# EAGLE design hand_brd (EAGLE 7.5.0)
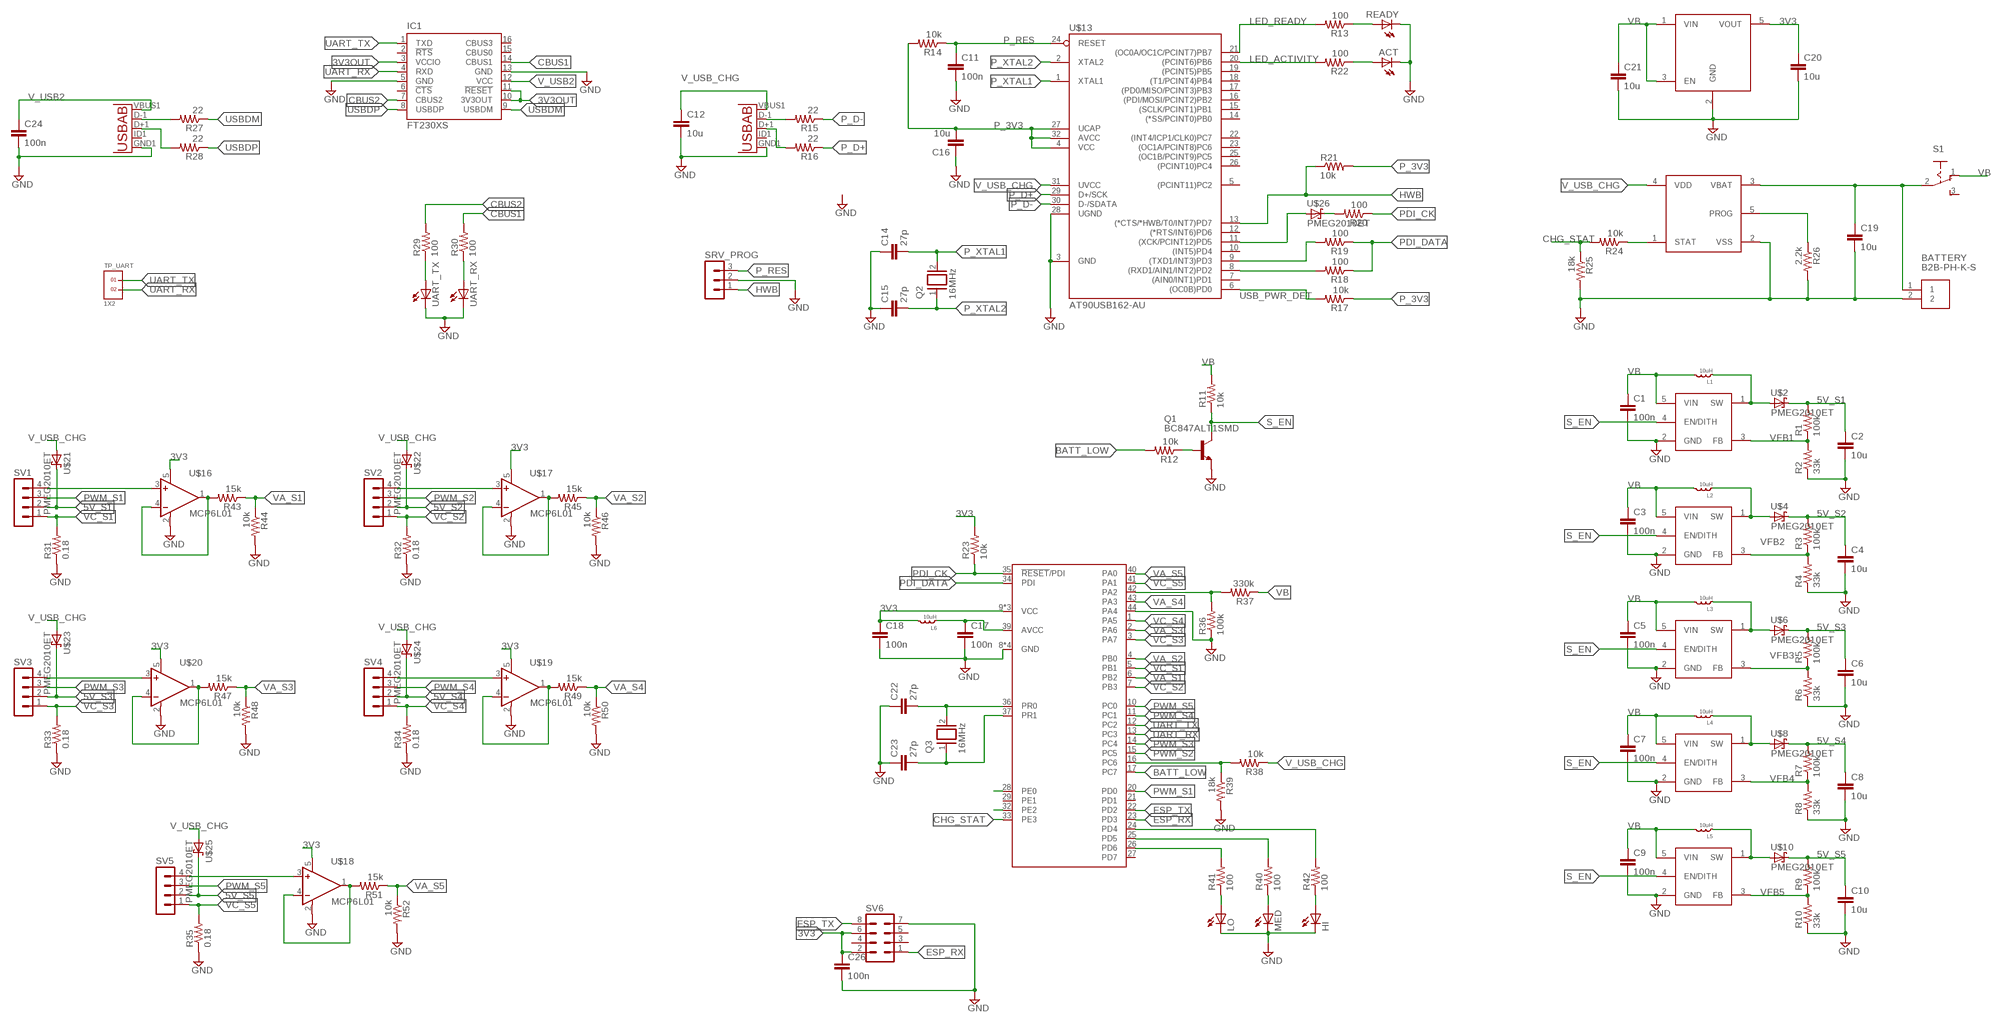
[diagram p0: schematic, sheet 1]

## Parts
ACT  LEDCHIPLED_0805  [CHIPLED_0805]
BATTERY  B2B-PH-K-S  [B2B-PH-K-S]
C1  100n  C-EUC0805K  [C0805K]
C2  10u  C-EUC0805K  [C0805K]
C3  100n  C-EUC0805K  [C0805K]
C4  10u  C-EUC0805K  [C0805K]
C5  100n  C-EUC0805K  [C0805K]
C6  10u  C-EUC0805K  [C0805K]
C7  100n  C-EUC0805K  [C0805K]
C8  10u  C-EUC0805K  [C0805K]
C9  100n  C-EUC0805K  [C0805K]
C10  10u  C-EUC0805K  [C0805K]
C11  100n  C-EUC0805K  [C0805K]
C12  10u  C-EUC0805K  [C0805K]
C14  27p  C-EUC0805K  [C0805K]
C15  27p  C-EUC0805K  [C0805K]
C16  10u  C-EUC0805K  [C0805K]
C17  100n  C-EUC0805K  [C0805K]
C18  100n  C-EUC0805K  [C0805K]
C19  10u  C-EUC0805K  [C0805K]
C20  10u  C-EUC0805K  [C0805K]
C21  10u  C-EUC0805K  [C0805K]
C22  27p  C-EUC0805K  [C0805K]
C23  27p  C-EUC0805K  [C0805K]
C24  100n  C-EUC0805K  [C0805K]
C26  100n  C-EUC0805K  [C0805K]
HI  LEDCHIPLED_0805  [CHIPLED_0805]
IC1  FT230XS  [SSOP16]
L1  10uH  L_TDK_LTF5022  [LTF5022]
L2  10uH  L_TDK_LTF5022  [LTF5022]
L3  10uH  L_TDK_LTF5022  [LTF5022]
L4  10uH  L_TDK_LTF5022  [LTF5022]
L5  10uH  L_TDK_LTF5022  [LTF5022]
L6  10uH  L_TDK_LTF5022  [LTF5022]
LO  LEDCHIPLED_0805  [CHIPLED_0805]
MED  LEDCHIPLED_0805  [CHIPLED_0805]
Q1  BC847ALT1SMD  [SOT23]
Q2  16MHz  XTAL/S  [QS]
Q3  16MHz  XTAL/S  [QS]
R1  100k  R-US_M0805  [M0805]
R2  33k  R-US_M0805  [M0805]
R3  100k  R-US_M0805  [M0805]
R4  33k  R-US_M0805  [M0805]
R5  100k  R-US_M0805  [M0805]
R6  33k  R-US_M0805  [M0805]
R7  100k  R-US_M0805  [M0805]
R8  33k  R-US_M0805  [M0805]
R9  100k  R-US_M0805  [M0805]
R10  33k  R-US_M0805  [M0805]
R11  10k  R-US_M0805  [M0805]
R12  10k  R-US_M0805  [M0805]
R13  100  R-US_M0805  [M0805]
R14  10k  R-US_M0805  [M0805]
R15  22  R-US_M0805  [M0805]
R16  22  R-US_M0805  [M0805]
R17  10k  R-US_M0805  [M0805]
R18  100  R-US_M0805  [M0805]
R19  100  R-US_M0805  [M0805]
R20  100  R-US_M0805  [M0805]
R21  10k  R-US_M0805  [M0805]
R22  100  R-US_M0805  [M0805]
R23  10k  R-US_M0805  [M0805]
R24  10k  R-US_M0805  [M0805]
R25  18k  R-US_M0805  [M0805]
R26  2.2k  R-US_M0805  [M0805]
R27  22  R-US_M0805  [M0805]
R28  22  R-US_M0805  [M0805]
R29  100  R-US_M0805  [M0805]
R30  100  R-US_M0805  [M0805]
R31  0.18  R-US_M0805  [M0805]
R32  0.18  R-US_M0805  [M0805]
R33  0.18  R-US_M0805  [M0805]
R34  0.18  R-US_M0805  [M0805]
R35  0.18  R-US_M0805  [M0805]
R36  100k  R-US_M0805  [M0805]
R37  330k  R-US_M0805  [M0805]
R38  10k  R-US_M0805  [M0805]
R39  18k  R-US_M0805  [M0805]
R40  100  R-US_M0805  [M0805]
R41  100  R-US_M0805  [M0805]
R42  100  R-US_M0805  [M0805]
R43  15k  R-US_M0805  [M0805]
R44  10k  R-US_M0805  [M0805]
R45  15k  R-US_M0805  [M0805]
R46  10k  R-US_M0805  [M0805]
R47  15k  R-US_M0805  [M0805]
R48  10k  R-US_M0805  [M0805]
R49  15k  R-US_M0805  [M0805]
R50  10k  R-US_M0805  [M0805]
R51  15k  R-US_M0805  [M0805]
R52  10k  R-US_M0805  [M0805]
READY  LEDCHIPLED_0805  [CHIPLED_0805]
S1  255SB  [255SB]
SRV_PROG  MA03-1  [MA03-1]
SV1  MA04-1  [MA04-1]
SV2  MA04-1  [MA04-1]
SV3  MA04-1  [MA04-1]
SV4  MA04-1  [MA04-1]
SV5  MA04-1  [MA04-1]
SV6  MA04-2  [MA04-2]
TP_UART  1X2  [1X2]
U1  USB""  [USB-MICRO-SMD]
U2  ATXMEGA128D4-AU  [TQFP-44A-44]
U3  USB""  [USB-MICRO-SMD]
U$1  MIC2250-2YD5  [SOT23-5]
U$2  PMEG2010ET  [SOT23]
U$3  MIC2250-2YD5  [SOT23-5]
U$4  PMEG2010ET  [SOT23]
U$5  MIC2250-2YD5  [SOT23-5]
U$6  PMEG2010ET  [SOT23]
U$7  MIC2250-2YD5  [SOT23-5]
U$8  PMEG2010ET  [SOT23]
U$9  MIC2250-2YD5  [SOT23-5]
U$10  PMEG2010ET  [SOT23]
U$13  AT90USB162-AU  [TQFP32-08]
U$14  MCP73831  [SOT23-5]
U$15  MIC5504  [SOT23-5]
U$16  MCP6L01  [SOT23-5]
U$17  MCP6L01  [SOT23-5]
U$18  MCP6L01  [SOT23-5]
U$19  MCP6L01  [SOT23-5]
U$20  MCP6L01  [SOT23-5]
U$21  PMEG2010ET  [SOT23]
U$22  PMEG2010ET  [SOT23]
U$23  PMEG2010ET  [SOT23]
U$24  PMEG2010ET  [SOT23]
U$25  PMEG2010ET  [SOT23]
U$26  PMEG2010ET  [SOT23]
UART_RX  LEDCHIPLED_0805  [CHIPLED_0805]
UART_TX  LEDCHIPLED_0805  [CHIPLED_0805]

## Nets
3V3: C18.1 C20.1 C26.1 L6.P$2 R23.2 SV6.2 SV6.6 U2.9(VCC) U2.19(VCC) U2.31(VCC) U$15.5(VOUT) U$16.5(V+) U$17.5(V+) U$18.5(V+) U$19.5(V+) U$20.5(V+)
3V3OUT: IC1.3(VCCIO) IC1.10(3V3OUT) IC1.11(!RESET)
5V_S1: C2.1 R1.2 SV1.2 U$2.3(C) U$21.3(C)
5V_S2: C4.1 R3.2 SV2.2 U$4.3(C) U$22.3(C)
5V_S3: C6.1 R5.2 SV3.2 U$6.3(C) U$23.3(C)
5V_S4: C8.1 R7.2 SV4.2 U$8.3(C) U$24.3(C)
5V_S5: C10.1 R9.2 SV5.2 U$10.3(C) U$25.3(C)
BATT_LOW: R12.2 U2.17(PC7)
CBUS1: IC1.14(CBUS1) R30.2
CBUS2: IC1.7(CBUS2) R29.2
CHG_STAT: R24.2 R25.1 U2.33(PE3)
ESP_RX: SV6.1 U2.23(PD3)
ESP_TX: SV6.8 U2.22(PD2)
GND: ACT.C BATTERY.2 C1.2 C2.2 C3.2 C4.2 C5.2 C6.2 C7.2 C8.2 C9.2 C10.2 C11.2 C12.2 C14.1 C15.1 C16.1 C17.2 C18.2 C19.2 C20.2 C21.2 C22.1 C23.1 C24.2 C26.2 HI.C IC1.5(GND) IC1.13(GND) LO.C MED.C Q1.2(E) R2.1 R4.1 R6.1 R8.1 R10.1 R25.2 R26.2 R31.1 R32.1 R33.1 R34.1 R35.1 R36.1 R39.2 R44.2 R46.2 R48.2 R50.2 R52.2 READY.C SRV_PROG.2 SV6.7 U1.GND1(GND) U2.8(GND) U2.18(GND) U2.30(GND) U2.38(GND) U2.44(PA4) U3.GND1(GND) U$1.2(GND) U$3.2(GND) U$5.2(GND) U$7.2(GND) U$9.2(GND) U$13.3(GND) U$13.28(UGND) U$14.2(VSS) U$15.2(GND) U$16.2(V-) U$17.2(V-) U$18.2(V-) U$19.2(V-) U$20.2(V-) UART_RX.C UART_TX.C
HWB: R21.1 SRV_PROG.1 U$13.13((*CTS/*HWB/T0/INT7)PD7)
LED_ACTIVITY: R22.2 U$13.20((PCINT6)PB6)
LED_READY: R13.2 U$13.21((OC0A/OC1C/PCINT7)PB7)
N$1: L2.P$1 U$3.1(SW) U$4.1(A)
N$2: L1.P$1 U$1.1(SW) U$2.1(A)
N$3: R18.2 U$13.8((RXD1/AIN1/INT2)PD2)
N$4: L3.P$1 U$5.1(SW) U$6.1(A)
N$5: Q1.1(B) R12.1
N$7: L4.P$1 U$7.1(SW) U$8.1(A)
N$8: R16.2 U3.D+1(D+)
N$9: L5.P$1 U$9.1(SW) U$10.1(A)
N$10: R15.2 U3.D-1(D-)
N$11: R20.2 U$26.3(C)
N$13: R19.2 U$13.9((TXD1/INT3)PD3)
N$14: U$13.11((XCK/PCINT12)PD5) U$26.1(A)
N$15: R13.1 READY.A
N$16: ACT.A R22.1
N$17: C17.1 L6.P$1 U2.39(AVCC)
N$18: R27.2 U1.D-1(D-)
N$19: R24.1 U$14.1(STAT)
N$20: R26.1 U$14.5(PROG)
N$21: BATTERY.1 C19.1 S1.2(P) U$14.3(VBAT)
N$22: R28.2 U1.D+1(D+)
N$25: R29.1 UART_TX.A
N$26: R30.1 UART_RX.A
N$34: R36.2 R37.2 U2.42(PA2)
N$35: R38.2 R39.1 U2.16(PC6)
N$36: SV2.4 U$17.3(+IN)
N$37: SV1.4 U$16.3(+IN)
N$38: SV5.4 U$18.3(+IN)
N$39: MED.A R40.1
N$40: SV3.4 U$20.3(+IN)
N$41: SV4.4 U$19.3(+IN)
N$42: LO.A R41.1
N$43: HI.A R42.1
N$44: R41.2 U2.26(PD6)
N$45: R40.2 U2.25(PD5)
N$46: R42.2 U2.24(PD4)
N$48: U2.28(PE0)
N$50: R45.2 U$17.1(OUT) U$17.4(-IN)
N$51: U2.32(PE2)
N$52: R43.2 U$16.1(OUT) U$16.4(-IN)
N$53: R47.2 U$20.1(OUT) U$20.4(-IN)
N$54: R49.2 U$19.1(OUT) U$19.4(-IN)
N$55: R51.2 U$18.1(OUT) U$18.4(-IN)
P_3V3: C16.2 R14.2 R17.1 R21.2 U$13.4(VCC) U$13.27(UCAP) U$13.32(AVCC)
P_D+: R16.1 U$13.29(D+/SCK)
P_D-: R15.1 U$13.30(D-/SDATA)
P_RES: C11.1 R14.1 SRV_PROG.3 U$13.24(RESET)
P_XTAL1: C14.2 Q2.2 U$13.1(XTAL1)
P_XTAL2: C15.2 Q2.1 U$13.2(XTAL2)
PDI_CK: R20.1 R23.1 U2.35(!RESET!/PDI)
PDI_DATA: R18.1 R19.1 U2.34(PDI)
PWM_S1: SV1.3 U2.20(PD0)
PWM_S2: SV2.3 U2.15(PC5)
PWM_S3: SV3.3 U2.14(PC4)
PWM_S4: SV4.3 U2.11(PC1)
PWM_S5: SV5.3 U2.10(PC0)
S_EN: Q1.3(C) R11.1 U$1.4(EN/DITH) U$3.4(EN/DITH) U$5.4(EN/DITH) U$7.4(EN/DITH) U$9.4(EN/DITH)
UART_RX: IC1.4(RXD) TP_UART.2 U2.13(PC3)
UART_TX: IC1.1(TXD) TP_UART.1 U2.12(PC2)
USB_PWR_DET: R17.2 U$13.6((OC0B)PD0)
USBDM: IC1.9(USBDM) R27.1
USBDP: IC1.8(USBDP) R28.1
V_USB2: C24.1 IC1.12(VCC) U1.VBUS1(VBUS)
V_USB_CHG: C12.1 R38.1 U3.VBUS1(VBUS) U$13.31(UVCC) U$14.4(VDD) U$21.1(A) U$22.1(A) U$23.1(A) U$24.1(A) U$25.1(A)
VA_S1: R43.1 R44.1 U2.6(PB2)
VA_S2: R45.1 R46.1 U2.4(PB0)
VA_S3: R47.1 R48.1 U2.2(PA6)
VA_S4: R49.1 R50.1 U2.43(PA3)
VA_S5: R51.1 R52.1 U2.40(PA0)
VB: C1.1 C3.1 C5.1 C7.1 C9.1 C21.1 L1.P$2 L2.P$2 L3.P$2 L4.P$2 L5.P$2 R11.2 R37.1 S1.1(O) U$1.5(VIN) U$3.5(VIN) U$5.5(VIN) U$7.5(VIN) U$9.5(VIN) U$15.1(VIN) U$15.3(EN)
VC_S1: R31.2 SV1.1 U2.5(PB1)
VC_S2: R32.2 SV2.1 U2.7(PB3)
VC_S3: R33.2 SV3.1 U2.3(PA7)
VC_S4: R34.2 SV4.1 U2.1(PA5)
VC_S5: R35.2 SV5.1 U2.41(PA1)
VFB1: R1.1 R2.2 U$1.3(FB)
VFB2: R3.1 R4.2 U$3.3(FB)
VFB3: R5.1 R6.2 U$5.3(FB)
VFB4: R7.1 R8.2 U$7.3(FB)
VFB5: R9.1 R10.2 U$9.3(FB)
XTAL1: C22.2 Q3.2 U2.36(PR0)
XTAL2: C23.2 Q3.1 U2.37(PR1)
Unconnected: IC1.2(!RTS) IC1.6(!CTS) IC1.15(CBUS0) IC1.16(CBUS3) S1.3(S) SV6.3 SV6.4 SV6.5 U1.ID1(USBID) U2.21(PD1) U2.27(PD7) U2.29(PE1) U3.ID1(USBID) U$13.5((PCINT11)PC2) U$13.7((AIN0/INT1)PD1) U$13.10((INT5)PD4) U$13.12((*RTS/INT6)PD6) U$13.14((*SS/PCINT0)PB0) U$13.15((SCLK/PCINT1)PB1) U$13.16((PDI/MOSI/PCINT2)PB2) U$13.17((PD0/MISO/PCINT3)PB3) U$13.18((T1/PCINT4)PB4) U$13.19((PCINT5)PB5) U$13.22((INT4/ICP1/CLK0)PC7) U$13.23((OC1A/PCINT8)PC6) U$13.25((OC1B/PCINT9)PC5) U$13.26((PCINT10)PC4)

## Library data of the parts
ACT HI LO MED READY UART_RX UART_TX = led:LED: LED OSRAM: - CHIPLED LG R971, LG N971, LY N971, LG Q971, LY Q971, LO R971, LY R971 LH N974, LH R974 LS Q976, LO Q976, LY Q976 LO Q996 - Hyper CHIPLED LW Q18S LB Q993, LB Q99A, LB R99A - SideLED LS A670, LO A670, LY A670, LG A670, LP A670 LB A673, LV A673, LT A673, LW A673 LH A674 LY A675 LS A676, LA A676, LO A676, LY A676, LW A676 LS A679, LY A679, LG A679 - Hyper Micro SIDELED® LS Y876, LA Y876, LO Y876, LY Y876 LT Y87S - SmartLED LW L88C, LW L88S LB L89C, LB L89S, LG L890 LS L89K, LO L89K, LY L89K LS L896, LA L896, LO L896, LY L896 - TOPLED LS T670, LO T670, LY T670, LG T670, LP T670 LSG T670, LSP T670, LSY T670, LOP T670, LYG T670 LG T671, LOG T671, LSG T671 LB T673, LV T673, LT T673, LW T673 LH T674 LS T676, LA T676, LO T676, LY T676, LB T676, LH T676, LSB T676, LW T676 LB T67C, LV T67C, LT T67C, LS T67K, LO T67K, LY T67K, LW E67C LS E67B, LA E67B, LO E67B, LY E67B, LB E67C, LV E67C, LT E67C LW T67C LS T679, LY T679, LG T679 LS T770, LO T770, LY T770, LG T770, LP T770 LB T773, LV T773, LT T773, LW T773 LH T774 LS E675, LA E675, LY E675, LS T675 LS T776, LA T776, LO T776, LY T776, LB T776 LHGB T686 LT T68C, LB T68C - Hyper Mini TOPLED® LB M676 - Mini TOPLED Santana® LG M470 LS M47K, LO M47K, LY M47K Source: http://www.osram.convergy.de LUXEON: - LUMILED® LXK2-PW12-R00, LXK2-PW12-S00, LXK2-PW14-U00, LXK2-PW14-V00 LXK2-PM12-R00, LXK2-PM12-S00, LXK2-PM14-U00 LXK2-PE12-Q00, LXK2-PE12-R00, LXK2-PE12-S00, LXK2-PE14-T00, LXK2-PE14-U00 LXK2-PB12-K00, LXK2-PB12-L00, LXK2-PB12-M00, LXK2-PB14-N00, LXK2-PB14-P00, LXK2-PB14-Q00 LXK2-PR12-L00, LXK2-PR12-M00, LXK2-PR14-Q00, LXK2-PR14-R00 LXK2-PD12-Q00, LXK2-PD12-R00, LXK2-PD12-S00 LXK2-PH12-R00, LXK2-PH12-S00 LXK2-PL12-P00, LXK2-PL12-Q00, LXK2-PL12-R00 Source: www.luxeon.com KINGBRIGHT: KA-3528ASYC Source: www.kingbright.com
BATTERY = jst:B2B-PH-K-S
C1-C12 C14-C24 C26 = rcl:C-EU: CAPACITOR, European symbol
IC1 = ftdi:FT230X: USB to BASIC UART IC Auto generated by make-symbol-device-package-bsdl.ulp Rev. 43 Source: Data sheet <http://www.ftdichip.com/Support/Documents/DataSheets/ICs/DS_FT230X.pdf>
L1-L6 = pol:L_TDK_LTF5022
Q1 = transistor-npn:BC847*: NPN Transistor
Q2 Q3 = special:XTAL/S: CRYSTAL
R1-R52 = rcl:R-US_: RESISTOR, American symbol
S1 = switch:255SB: SLIDING SWITCH Distributor Buerklin, 11G810
SRV_PROG = con-lstb:MA03-1: PIN HEADER; OC_FARNELL: unknown; OC_NEWARK: unknown
SV1-SV5 = con-lstb:MA04-1: PIN HEADER; OC_FARNELL: unknown; OC_NEWARK: unknown
SV6 = con-lstb:MA04-2: PIN HEADER; OC_FARNELL: unknown; OC_NEWARK: unknown
TP_UART = headers(2mm):1X2
U1 U3 = MicroUSB:USB: This is a USB AB connector that is compatible with USB OTG. i.e. this connector can serve as a host or device
U2 = atmel-xmega:ATXMEGA128D4: 8/16-bit XMEGA C4 Microcontroller Features High-performance, Low-power 8/16-bit Atmel® AVR® XMEGA® Microcontroller Non-volatile Program and Data Memories – 16 KB - 128 KB of In-System Self-Programmable Flash – 4 KB - 8 KB Boot Code Section with Independent Lock Bits – 1 KB - 2 KB EEPROM – 2 KB - 8 KB Internal SRAM Peripheral Features – Four-channel Event System – Four 16-bit Timer/Counters Three Timer/Counters with 4 Output Compare or Input Capture channels One Timer/Counter with 2 Output Compare or Input Capture channels High-Resolution Extensions on two Timer/Counters Advanced Waveform Extension on one Timer/Counter – Two USARTs IrDA Extension on one USART – Two Two-Wire Interfaces with dual address match (I2C and SMBus compatible) – Two SPIs (Serial Peripheral Interfaces) peripherals – 16-bit Real Time Counter with Separate Oscillator – One Twelve-channel, 12-bit, 200 ksps Analog to Digital Converter – Two Analog Comparators with Window compare function – External Interrupts on all General Purpose I/O pins – Programmable Watchdog Timer with Separate On-chip Ultra Low Power Oscillator Special Microcontroller Features – Power-on Reset and Programmable Brown-out Detection – Internal and External Clock Options with PLL – Programmable Multi-level Interrupt Controller – Sleep Modes: Idle, Power-down, Standby, Power-save, Extended Standby – Advanced Programming, Test and Debugging Interface PDI (Program and Debug Interface) for programming, test and debugging I/O and Packages – 34 Programmable I/O Lines – 44-lead TQFP – 44-pad VQFN/QFN – 49-ball VFBGA Operating Voltage – 1.6 – 3.6V Speed performance – 0 – 12 MHz @ 1.6 – 3.6V – 0 – 32 MHz @ 2.7 – 3.6V
U$1 U$3 U$5 U$7 U$9 = pol:MIC2250-2YD5
U$2 U$4 U$6 U$8 U$10 U$21-U$26 = pol:PMEG2010ET
U$13 = at90usb:AT90USB162-*
U$14 = pol:MCP73831
U$15 = pol:MIC5504
U$16-U$20 = pol:MCP6L01: MCP6L01 1.8-6V rail to rail opamp

## Board
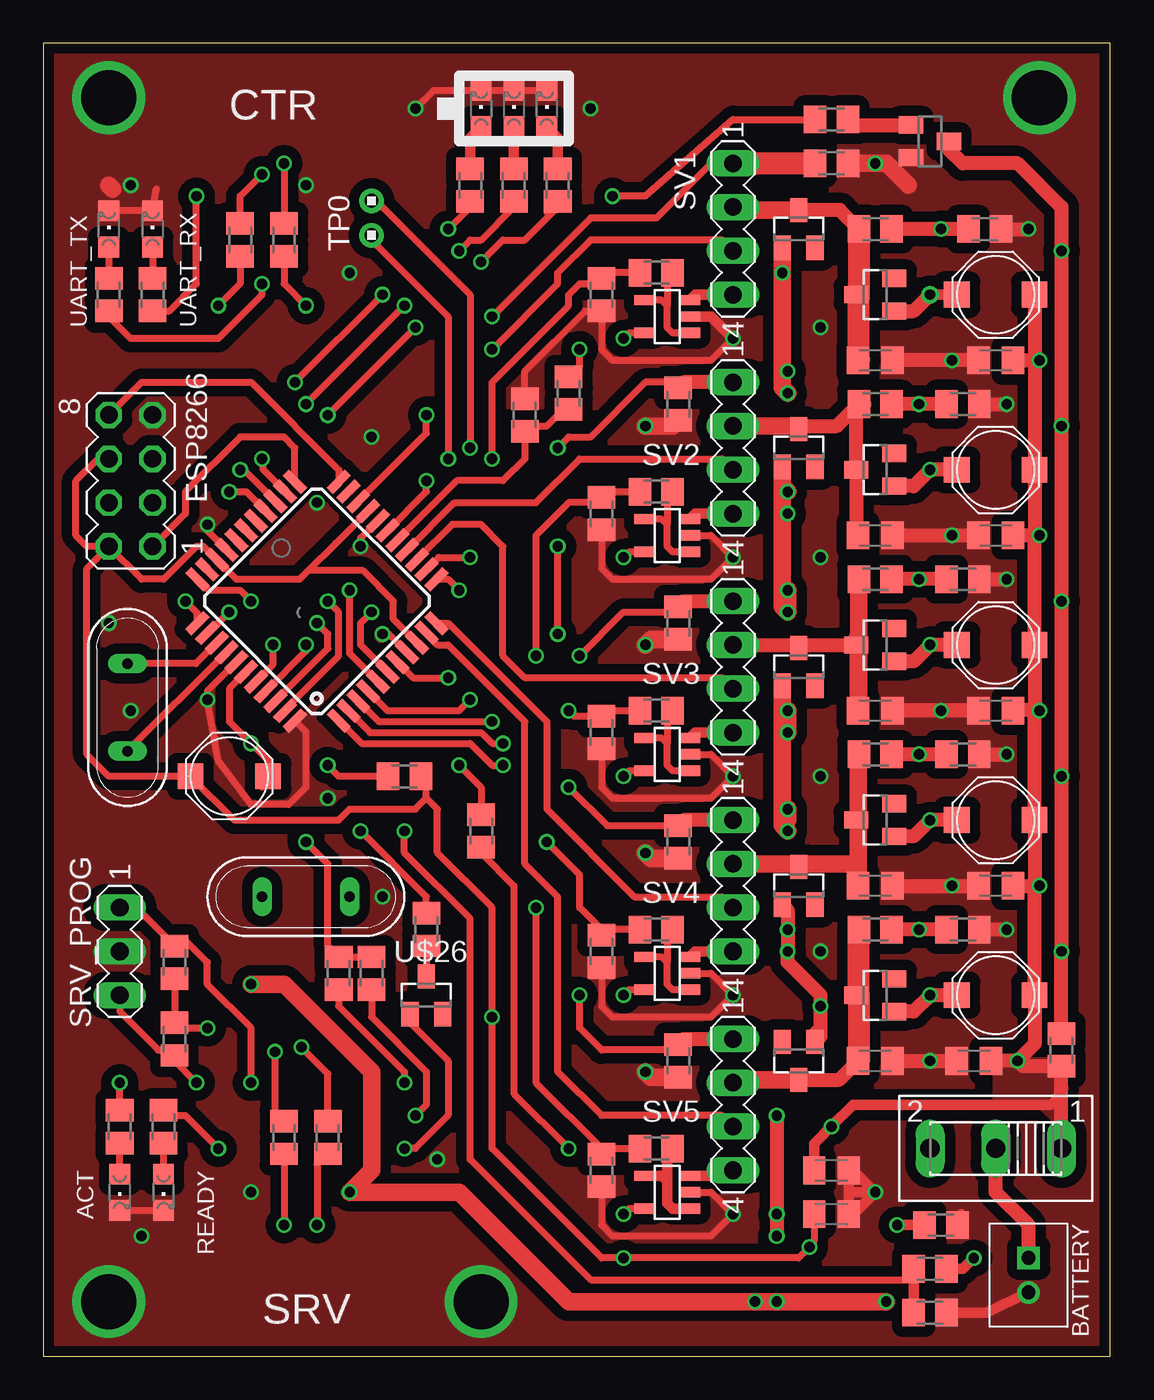
[diagram p1: board, top side]
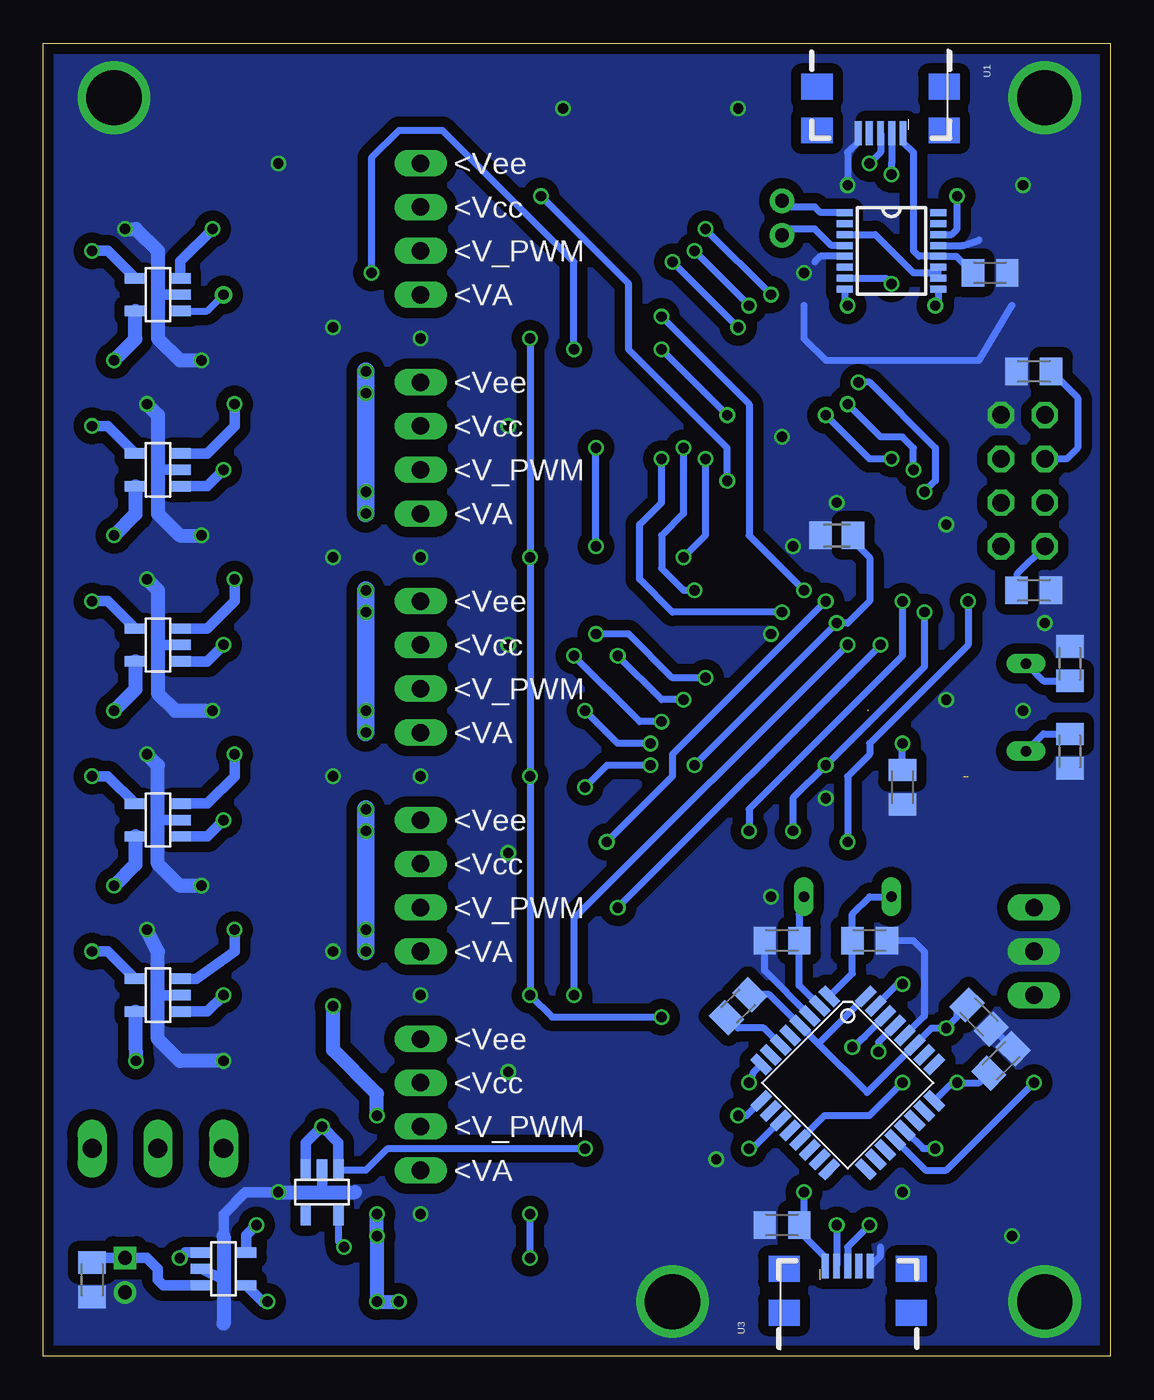
[diagram p2: board, bottom side, seen from below]

Size 61.9 x 76.19 mm. Coordinates in mm from the lower left corner, seen from the top.
Outline: 0,0 61.9,0 61.9,76.19 0,76.19 0,0
Copper layers (1*16): Top 0.035mm / dielectric 1.5mm / Bottom 0.035mm
Design rules "dirt_cheap_dirty_boards.v1": minimum track width 5mil, minimum drill 12mil, track to track 5mil, track to pad 5mil, pad to pad 5mil, via to via 5mil, smd to smd 0mil, copper to edge 10mil, drill to drill 10mil, minimum pad ring 10mil, minimum via ring 6mil, stop-mask expansion 2mil, vias tented up to drill 25mil, thermal gap 10mil

### Footprints (pad centres in the part's own frame; a part is rotated, then mirrored left to right if it is on the bottom)
CHIPLED_0805 = smd 1.2 x 1.2: A 0,-1.05; C 0,1.05
B2B-PH-K-S = drill 0.8 square: 1 0,0 | drill 0.8: 2 2,0
C0805K = smd 1.3 x 1.6: 1 -1,0; 2 1,0
SSOP16 = smd 0.914 x 0.406: 1 -2.718,2.223; 2 -2.718,1.587; 3 -2.718,0.953; 4 -2.718,0.318; 5 -2.718,-0.318; 6 -2.718,-0.953; 7 -2.718,-1.587; 8 -2.718,-2.223; 9 2.718,-2.223; 10 2.718,-1.587; 11 2.718,-0.953; 12 2.718,-0.318; 13 2.718,0.318; 14 2.718,0.953; 15 2.718,1.587; 16 2.718,2.223
LTF5022 = smd 1.5 x 1.5: P$1 -2.25,0; P$2 2.25,0
SOT23 = smd 1 x 1.4: 1 -0.95,-1.1; 2 0.95,-1.1; 3 0,1.1
QS = drill 0.61 long: 1 -2.54,0; 2 2.54,0
M0805 = smd 1.3 x 1.6: 1 -0.95,0; 2 0.95,0
255SB = drill 1.118 long: 1 -3.81,0; 2 0,0; 3 3.81,0
MA03-1 = drill 1.016 long: 1 -2.54,0; 2 0,0; 3 2.54,0
MA04-1 = drill 1.016 long: 1 -3.81,0; 2 -1.27,0; 3 1.27,0; 4 3.81,0
MA04-2 = drill 1.016 octagon: 1 -3.81,-1.27; 2 -3.81,1.27; 3 -1.27,-1.27; 4 -1.27,1.27; 5 1.27,-1.27; 6 1.27,1.27; 7 3.81,-1.27; 8 3.81,1.27
1X2 = drill 0.8 pad 1.422: 1 -1,0; 2 1,0
USB-MICRO-SMD = smd 1.4 x 0.4: D+1 2.7,0; D-1 2.7,0.65; GND1 2.7,-1.3; ID1 2.7,-0.65; VBUS1 2.7,1.3
TQFP-44A-44 = smd 1.5 x 0.5: 1 -5.8,4; 2 -5.8,3.2; 3 -5.8,2.4; 4 -5.8,1.6; 5 -5.8,0.8; 6 -5.8,0; 7 -5.8,-0.8; 8 -5.8,-1.6; 9 -5.8,-2.4; 10 -5.8,-3.2; 11 -5.8,-4; 23 5.8,-4; 24 5.8,-3.2; 25 5.8,-2.4; 26 5.8,-1.6; 27 5.8,-0.8; 28 5.8,0; 29 5.8,0.8; 30 5.8,1.6; 31 5.8,2.4; 32 5.8,3.2; 33 5.8,4 | smd 0.5 x 1.5: 12 -4,-5.8; 13 -3.2,-5.8; 14 -2.4,-5.8; 15 -1.6,-5.8; 16 -0.8,-5.8; 17 0,-5.8; 18 0.8,-5.8; 19 1.6,-5.8; 20 2.4,-5.8; 21 3.2,-5.8; 22 4,-5.8; 34 4,5.8; 35 3.2,5.8; 36 2.4,5.8; 37 1.6,5.8; 38 0.8,5.8; 39 0,5.8; 40 -0.8,5.8; 41 -1.6,5.8; 42 -2.4,5.8; 43 -3.2,5.8; 44 -4,5.8
SOT23-5 = smd 0.6 x 1.2: 1 -0.95,-1.306; 2 0,-1.306; 3 0.95,-1.306; 4 0.95,1.306; 5 -0.95,1.306
TQFP32-08 = smd 1.27 x 0.533: 1 -4.293,2.8; 2 -4.293,2; 3 -4.293,1.2; 4 -4.293,0.4; 5 -4.293,-0.4; 6 -4.293,-1.2; 7 -4.293,-2; 8 -4.293,-2.8; 17 4.293,-2.8; 18 4.293,-2; 19 4.293,-1.2; 20 4.293,-0.4; 21 4.293,0.4; 22 4.293,1.2; 23 4.293,2; 24 4.293,2.8 | smd 0.533 x 1.27: 9 -2.8,-4.293; 10 -2,-4.293; 11 -1.2,-4.293; 12 -0.4,-4.293; 13 0.4,-4.293; 14 1.2,-4.293; 15 2,-4.293; 16 2.8,-4.293; 25 2.8,4.293; 26 2,4.293; 27 1.2,4.293; 28 0.4,4.293; 29 -0.4,4.293; 30 -1.2,4.293; 31 -2,4.293; 32 -2.8,4.293

### Placement (x,y rotation side)
ACT  4.45,9.53 180 top
BATTERY  57.15,5.71 270 top
C1  55.25,57.78 180 top
C2  48.26,57.78 0 top
C3  55.25,47.62 180 top
C4  48.26,47.62 0 top
C5  55.25,27.31 180 top
C6  48.26,37.46 0 top
C7  55.25,37.46 180 top
C8  48.26,27.31 0 top
C9  53.97,17.15 180 top
C10  48.26,17.15 0 top
C11  6.35,17.15 45 bottom
C12  19.05,7.62 180 bottom
C14  13.97,24.13 180 bottom
C15  19.05,24.13 0 bottom
C16  7.62,19.69 135 bottom
C17  12.06,33.02 270 bottom
C18  4.45,44.45 0 bottom
C19  59.06,4.45 270 bottom
C20  45.72,8.26 0 top
C21  45.72,10.79 0 top
C22  2.35,40.19 270 bottom
C23  2.35,35.11 90 bottom
C24  6.98,62.86 0 bottom
C26  4.45,57.15 180 bottom
HI  29.21,72.39 0 top
IC1  12.7,64.14 0 bottom
L1  55.25,61.59 0 top
L2  55.25,51.43 0 top
L3  55.25,41.27 0 top
L4  55.25,31.12 0 top
L5  55.25,20.96 0 top
L6  10.8,33.66 180 top
LO  25.4,72.39 0 top
MED  27.31,72.39 0 top
Q1  51.44,70.48 270 top
Q2  15.24,26.67 180 top
Q3  4.89,37.65 90 top
R1  48.26,65.41 180 top
R2  54.61,65.41 180 top
R3  48.26,55.24 180 top
R4  53.34,55.24 180 top
R5  48.26,45.09 180 top
R6  53.34,45.09 180 top
R7  48.26,34.92 180 top
R8  53.34,34.92 180 top
R9  48.26,24.77 180 top
R10  53.34,24.77 180 top
R11  59.06,17.78 270 top
R12  45.72,71.76 180 top
R13  6.98,13.33 90 top
R14  7.62,18.42 90 top
R15  16.51,12.7 270 top
R16  13.97,12.7 270 top
R17  21.59,20.32 225 bottom
R18  17.15,22.23 270 top
R19  19.05,22.23 270 top
R20  22.23,24.77 270 top
R21  7.62,22.86 270 top
R22  4.45,13.33 90 top
R23  20.95,33.66 0 top
R24  51.44,5.08 180 top
R25  51.44,2.54 0 top
R26  52.07,7.62 0 top
R27  11.43,64.77 90 top
R28  13.97,64.77 90 top
R29  3.81,61.59 270 top
R30  6.35,61.59 270 top
R31  45.72,69.22 180 top
R32  36.83,55.24 90 top
R33  36.83,42.54 90 top
R34  36.83,29.85 90 top
R35  36.83,17.15 90 top
R36  15.88,47.62 0 bottom
R37  25.4,30.48 90 top
R38  30.48,55.88 270 top
R39  27.94,54.61 90 top
R40  27.31,67.95 270 top
R41  24.77,67.95 270 top
R42  29.84,67.95 270 top
R43  35.56,62.86 0 top
R44  32.39,61.59 270 top
R45  35.56,50.16 0 top
R46  32.39,48.89 270 top
R47  35.56,37.46 0 top
R48  32.39,36.2 270 top
R49  35.56,24.77 0 top
R50  32.39,23.5 270 top
R51  35.56,12.06 0 top
R52  32.39,10.79 270 top
READY  6.98,9.53 180 top
S1  55.25,12.06 180 top
SRV_PROG  4.45,23.5 270 top
SV1  40,65.41 270 top
SV2  40,52.7 270 top
SV3  40,40 270 top
SV4  40,27.31 270 top
SV5  40,14.61 270 top
SV6  5.08,50.8 90 top
TP_UART  19.05,66.04 270 top
U1  13.34,73.66 270 bottom
U2  15.88,43.81 135 top
U3  15.24,2.54 90 bottom
U$1  55.25,61.59 90 bottom
U$2  48.26,61.59 90 top
U$3  55.25,51.43 90 bottom
U$4  48.26,51.43 90 top
U$5  55.25,41.27 90 bottom
U$6  48.26,41.27 90 top
U$7  55.25,31.12 90 bottom
U$8  48.26,31.12 90 top
U$9  55.25,20.96 90 bottom
U$10  48.26,20.96 90 top
U$13  15.24,15.88 315 bottom
U$14  51.44,5.08 270 bottom
U$15  45.72,9.53 180 bottom
U$16  36.2,60.32 90 top
U$17  36.2,47.62 90 top
U$18  36.2,9.53 90 top
U$19  36.2,22.23 90 top
U$20  36.2,34.92 90 top
U$21  43.81,65.41 0 top
U$22  43.81,52.7 0 top
U$23  43.81,40 0 top
U$24  43.81,27.31 0 top
U$25  43.81,17.15 180 top
U$26  22.23,20.96 0 top
UART_RX  6.35,65.41 0 top
UART_TX  3.81,65.41 0 top

### Tracks (layer width: path | path; a pad name or v marks a point on that pad's centre or on a via)
3V3  (via drill 0.6)  (1 unrouted)
  Top 0.406: 34.61,33.98 U$20.5 33.97,33.98 v33.66,33.66 | 15.38,45.58 14.88,45.09 11.21,45.09 U2.31 9.31,46.99 8.89,46.99 6.98,45.09 5.72,45.09 SV6.2 | 15.38,45.58 16.97,47.17 U2.19 | SV6.2 2.54,46.99 1.91,47.62 1.91,50.8 3.17,52.07 SV6.6 | U$18.5 33.97,8.58 v33.66,8.26 | C20.1 44.72,6.71 v44.45,6.35 43.81,5.71 v33.66,5.71 32.39,5.71 26.03,12.06 v26.03,19.69 26.03,26.04 22.86,29.21 22.86,31.75 22.23,32.38 | U$19.5 33.97,21.28 v33.66,20.96 | U$17.5 33.97,46.67 v33.66,46.35 | U$16.5 33.97,59.38 v33.66,59.05 | U2.9 20.32,42.76 20.32,43.81 18.55,45.58 15.38,45.58 | 8.26,33.66 3.81,33.66 2.54,34.92 2.54,45.72 SV6.2 | L6.P$2 11.09,31.12 17.15,31.12 17.78,31.75 21.59,31.75 22.23,32.38 | 22.23,32.38 22.23,33.34 R23.2
  Bottom 0.406: v33.66,5.71 v33.66,8.26 | U$15.5 44.77,6.67 v44.45,6.35 | C26.1 1.91,55.61 1.91,52.7 2.54,52.07 SV6.6 | C18.1 5.4,44.5 5.4,45.4 SV6.2 | v33.66,59.05 v33.66,46.35 v33.66,33.66 v33.66,20.96 32.39,19.69 v26.03,19.69
3V3OUT
  Bottom 0.406: IC1.3 13.65,65.09 11.43,62.86 10.3,62.86 IC1.11 IC1.10
5V_S1
  Top 0.61: 47.31,57.84 C2.1 | 47.31,61.45 U$2.3
  Top 0.813: R1.2 46.21,66.51 U$21.3
  Top 1.016: SV1.2 39.54,66.51 U$21.3
  Top 1.27: R1.2 47.31,61.45 47.31,57.84
5V_S2
  Top 0.813: 47.62,55.24 R3.2 46.04,53.98 43.98,53.98 | C4.1 47.16,47.73 U$4.3 47.16,55.09
  Top 1.016: SV2.2 43.64,53.98 U$22.3 43.98,53.98 | R3.2 47.16,55.09
5V_S3
  Top 0.813: SV3.2 43.64,41.27 U$23.3 | 43.98,41.27 U$6.3
  Top 1.016: R5.2 47.31,37.52 C6.1 47.26,41.81 U$6.3 | U$23.3 43.98,41.27
5V_S4
  Top 0.61: U$8.3 47.26,31.12
  Top 1.016: C8.1 47.26,28.58 | R7.2 arc90 47.26,34.88 47.26,31.12 47.26,28.58 | SV4.2 43.64,28.58 arc-90 U$24.3 43.98,28.58 47.26,28.58
5V_S5
  Top 0.813: 47.31,17.2 C10.1 46.16,16.05 U$25.3 | U$10.3 47.31,20.96
  Top 1.016: SV5.2 40.17,16.05 U$25.3
  Top 1.27: 47.31,17.2 47.31,20.96 R9.2
BATT_LOW  (via drill 0.6)
  Top 0.406: U2.17 22.23,50.16 v22.23,50.8 | v33.02,67.31 34.92,67.31 40,71.76 R12.2
  Bottom 0.406: v22.23,50.8 22.23,52.7 27.94,58.42 27.94,62.23 v33.02,67.31
CBUS1  (via drill 0.6)
  Top 0.406: R30.2 7.3,60.64 8.89,62.23 v8.89,67.31
  Bottom 0.406: IC1.14 9.21,65.09 8.89,65.41 v8.89,67.31
CBUS2  (via drill 0.6)
  Top 0.406: 3.81,60.96 R29.2 3.81,60.32 5.08,59.05 10.16,59.05 12.7,61.59 v12.7,62.23
  Bottom 0.406: IC1.7 13.02,62.55 v12.7,62.23
CHG_STAT  (via drill 0.6)
  Top 0.406: R24.2 50.17,5.39 50.17,5.08 | U2.33 9.58,44.45 11.43,44.45 v12.06,43.81 | 50.48,4.45 31.75,4.45 24.77,11.43 24.77,25.4 20.95,29.21 v20.95,30.48
  Top 0.61: R25.1 50.48,4.45 R24.2
  Bottom 0.406: v12.06,43.81 12.06,40.64 20.95,31.75 v20.95,30.48
ESP_RX
  Top 0.406: U2.23 14.6,52.71 13.97,53.34 11.43,53.34 8.26,50.16 8.26,48.89 SV6.1
ESP_TX
  Top 0.406: SV6.8 5.72,56.52 12.06,56.52 17.15,51.43 U2.22 17.15,50.8
GND  (via drill 0.6, 3.2)
  Top 0.406: UART_TX.C UART_RX.C 6.57,67.73 | 4.45,8.26 ACT.C READY.C | U$19.2 38.73,22.23 v40,20.96 38.73,19.69 33.02,19.69 32.39,20.32 R50.2 | U$20.2 38.73,34.92 v40,33.66 38.73,32.38 33.02,32.38 32.39,33.02 R48.2 | U$17.2 38.73,47.62 v40,46.35 38.73,45.09 33.02,45.09 32.39,45.72 R46.2 | U$18.2 38.73,9.53 v40,8.26 38.73,6.98 33.02,6.98 32.39,7.62 R52.2 | U2.30 9.52,47.9 v9.52,48.26 | U2.18 18.41,47.49 v18.41,46.99 | U2.38 9.52,38.6 v9.52,38.1 10.16,34.56 C17.2 14.24,32.02 15.24,33.02 15.24,36.25 U2.44 | v19.69,41.91 20.04,41.91 U2.8 | v40,59.05 38.73,57.78 33.02,57.78 32.39,58.42 R44.2 31.44,60.64 27.94,57.15 R39.2 | HI.C MED.C LO.C 22.64,73.44 v21.59,72.39
  Top 0.61: R25.2 54.7,2.54 BATTERY.2 | R26.2 53.25,8.26 | v48.26,9.53 46.99,8.26 C20.2 C21.2 46.99,10.79 v48.26,9.53 | v48.26,9.53 46.99,9.53 | U$16.2 38.73,60.32 v40,59.05
  Top 0.813: R2.1 v57.15,65.41 | C1.2 v52.7,57.78 C2.2 | C7.2 v52.07,37.46 C6.2 | C4.2 v52.7,47.62 C3.2 | C8.2 v52.7,27.31 C5.2 | R8.1 v55.88,34.92 | C10.2 v51.44,17.15 C9.2 | R10.1 v55.88,24.77 | R4.1 v55.88,55.24 | R6.1 v55.88,45.09
  Top 1.016: R31.1 48.89,69.22 50.17,67.95 | v34.92,53.98 36.51,53.98 R32.1 | v34.92,41.27 35.25,41.59 R33.1 | v34.92,29.21 35.25,28.9 R34.1 | R35.1 35.25,16.2 v34.92,16.51 | 4.03,67.73 3.81,67.95
  Bottom 0.406: U$13.28 10.8,19.75 10.8,23.5 11.43,24.13 C14.1 | C11.2 6.77,18.98 C16.1 | U$13.3 20.05,22.38 C15.1 | IC1.13 8.57,64.45 7.62,64.77 | 17.78,60.96 17.78,59.05 16.51,57.78 7.62,57.78 5.72,60.96 | U1.GND1 14.63,70.45 15.24,69.85 v15.24,67.95 | IC1.5 16.83,63.82 17.15,63.5 | U3.GND1 13.34,5.84 13.34,6.35
  Bottom 0.61: 55.25,61.59 U$1.2 | U$5.2 55.25,41.27 | U$3.2 55.25,51.43 | U$7.2 55.25,31.12 | U$9.2 55.25,20.96 | U$14.2 51.44,4.45 | U$15.2 45.72,9.53 | 51.44,6.98 51.44,8.26 50.17,9.53 v48.26,9.53
  Bottom 0.813: v57.15,65.41 56.52,65.41 55.25,64.14 55.25,61.59 55.25,59.05 53.97,57.78 v52.7,57.78 | v52.7,47.62 53.97,47.62 55.25,48.89 55.25,51.43 55.25,54.61 v55.88,55.24 | v55.88,45.09 55.25,44.45 55.25,41.27 55.25,38.46 C7.2 v52.07,37.46 | v52.7,27.31 53.97,27.31 55.25,28.58 55.25,31.12 55.25,34.29 v55.88,34.92 | v51.44,17.15 53.97,17.15 55.25,18.42 55.25,20.96 55.25,23.5 v55.88,24.77 | 51.44,6.98 51.44,4.45 51.44,1.91 | v48.26,9.53 45.72,9.53 43.81,9.53
  other vias: 5.08,67.95 3.81,73.03 57.78,73.03 3.81,3.17 25.4,3.17 16.51,32.38 48.26,69.22 15.88,49.53 3.81,42.54 19.05,53.34 5.08,37.46 19.69,26.67 17.78,62.86 5.72,6.98 12.06,9.53 22.86,11.43 31.75,72.39 45.08,59.69 45.08,46.35 45.08,33.66 45.08,23.5
  pour Bottom (isolate 0.61, no thermals): 0.63,76.2 62.86,76.2 62.86,0 0.63,0
  pour Top (isolate 0.61, no thermals): 0.63,76.2 0.63,0 62.86,0 62.86,76.2
HWB  (via drill 0.6)
  Top 0.406: v12.06,15.88 12.06,19.05 9.52,21.59 9.52,22.86 8.26,24.13 7.94,24.13 R21.1 | 7.94,24.13 R21.1 | SRV_PROG.1 5.4,26.04 R21.1
  Bottom 0.406: U$13.13 16.58,13.97 13.97,13.97 v12.06,15.88
LED_ACTIVITY  (via drill 0.6)
  Top 0.406: R22.2 v4.45,15.88
  Bottom 0.406: U$13.20 10.73,10.79 9.52,10.79 v4.45,15.88
LED_READY  (via drill 0.6)
  Top 0.406: R13.2 7.3,13.97 8.26,13.97 v10.16,12.06
  Bottom 0.406: U$13.21 10.86,12.06 v10.16,12.06
N$1  (via drill 0.6)
  Top 0.813: L2.P$1 v51.44,51.43 50.48,50.48 U$4.1
  Bottom 0.61: U$3.1 52.39,50.48 v51.44,51.43
N$2  (via drill 0.6 pad 1.02)
  Top 0.61: L1.P$1 v51.44,61.59
  Top 0.813: U$2.1 50.48,60.64 v51.44,61.59
  Bottom 0.406: U$1.1 52.39,60.64 v51.44,61.59
N$3  (via drill 0.6)
  Top 0.406: v20.95,15.88 20.95,16.51 17.15,20.32 R18.2
  Bottom 0.406: U$13.8 20.68,16.51 v20.95,15.88
N$4  (via drill 0.6)
  Top 0.813: L3.P$1 v51.44,41.27 50.48,40.32 U$6.1
  Bottom 0.61: U$5.1 52.39,40.32 v51.44,41.27
N$5
  Top 0.813: R12.1 46.99,71.44 Q1.1
N$7  (via drill 0.6)
  Top 0.813: L4.P$1 v51.44,31.12 50.48,30.17 U$8.1
  Bottom 0.61: U$7.1 52.39,30.17 v51.44,31.12
N$8  (via drill 0.6)
  Top 0.406: R16.2 v13.97,7.62
  Bottom 0.406: v13.97,7.62 15.24,6.35 U3.D+1
N$9  (via drill 0.6)
  Top 0.813: L5.P$1 v51.44,20.96 50.48,20.01 U$10.1
  Bottom 0.61: U$9.1 52.39,20.01 v51.44,20.96
N$10  (via drill 0.6)
  Top 0.406: R15.2 15.89,11.13 15.89,7.63 v15.88,7.62
  Bottom 0.406: v15.88,7.62 U3.D-1
N$11
  Top 0.406: R20.2 U$26.3 22.23,21.59
N$13  (via drill 0.6)
  Top 0.406: v21.59,13.97 22.23,14.61 22.23,16.51 19.05,19.69 R19.2
  Bottom 0.406: U$13.9 21.11,13.97 v21.59,13.97
N$14  (via drill 0.6)
  Top 0.406: v20.95,12.06 21.59,12.06 23.49,13.97 23.49,17.15 21.27,19.37 U$26.1
  Bottom 0.406: U$13.11 20.75,12.06 v20.95,12.06
N$15
  Top 0.406: READY.A R13.1
N$16
  Top 0.406: ACT.A R22.1
N$17  (via drill 0.6)
  Top 0.406: 12.7,33.02 L6.P$1 13.05,34.58 v12.06,35.56 10.8,36.83 10.8,38.73 U2.39
  Bottom 0.406: C17.1 v12.06,35.56
N$18  (via drill 0.6)
  Top 0.406: R27.2 11.43,67.31 v12.7,68.58
  Bottom 0.406: U1.D-1 12.69,69.23 12.7,69.22 v12.7,68.58
N$19  (via drill 0.6)
  Top 0.61: R24.1 53.34,5.08 v53.97,5.71
  Bottom 0.61: U$14.1 53.66,6.03 v53.97,5.71
N$20  (via drill 0.6)
  Top 0.61: R26.1 v49.53,7.62
  Bottom 0.61: v49.53,7.62 50.13,7.02 U$14.5
N$21
  Top 0.813: BATTERY.1 57.15,7.62 55.25,9.53 S1.2
  Bottom 0.61: C19.1 58.78,5.71 BATTERY.1 55.88,5.71 55.25,5.08 55.25,4.45 54.93,4.13 U$14.3
N$22  (via drill 0.6)
  Top 0.406: v13.97,69.22 R28.2
  Bottom 0.406: U1.D+1 13.34,69.85 v13.97,69.22
N$25
  Top 0.406: UART_TX.A R29.1
N$26
  Top 0.406: UART_RX.A R30.1
N$34  (via drill 0.6)
  Top 0.406: U2.42 16.51,41.06 16.51,41.91 v15.88,42.54 | v24.13,34.29 25.4,33.02 R37.2
  Bottom 0.406: v24.13,34.29 v15.88,42.54 15.24,42.54 13.97,43.81 13.97,46.35 14.92,47.31 R36.2
N$35
  Top 0.406: U2.16 23.99,50.8 26.67,50.8 27.94,52.07 R39.1 28.25,53.98 29.21,53.98 30.48,55.24 R38.2
N$36
  Top 0.61: SV2.4 37.82,48.89 U$17.3
N$37
  Top 0.61: SV1.4 37.82,61.59 U$16.3
N$38
  Top 0.61: U$18.3 39.69,10.47 arc90 SV5.4
N$39
  Top 0.61: MED.A R40.1
N$40
  Top 0.61: SV3.4 37.82,36.2 U$20.3
N$41
  Top 0.61: SV4.4 37.82,23.5 U$19.3
N$42
  Top 0.61: LO.A 24.77,70.7 R41.1
N$43
  Top 0.61: HI.A 29.84,70.7 R42.1
N$44  (via drill 0.6)
  Top 0.406: v14.61,56.52 v19.69,61.59 | v10.8,50.16 11.79,50.16 U2.26 | v23.49,65.41 24.77,66.68 R41.2
  Bottom 0.406: v23.49,65.41 v19.69,61.59 | v10.8,50.16 10.16,50.8 10.16,52.7 13.97,56.52 v14.61,56.52
N$45  (via drill 0.6)
  Top 0.406: v15.24,55.24 v20.95,60.96 | U2.25 11.65,51.43 v11.43,51.43 | v24.13,64.14 24.77,64.77 25.4,64.77 27.31,66.68 R40.2
  Bottom 0.406: v24.13,64.14 v20.95,60.96 | v11.43,51.43 11.43,52.7 12.06,53.34 13.34,53.34 v15.24,55.24
N$46  (via drill 0.6)
  Top 0.406: v16.51,54.61 v21.59,59.69 | 13.96,50.18 U2.24 12.78,51.43 v12.7,52.07 | 30.48,66.68 29.21,66.36 R42.2 29.84,66.68 27.94,64.77 26.67,64.77 v25.4,63.5
  Bottom 0.406: v25.4,63.5 v21.59,59.69 | v12.7,52.07 13.97,52.07 v16.51,54.61
N$50
  Top 0.406: U$17.1 36.51,46.67 36.2,46.99 36.2,47.62 36.2,48.26 | 36.2,48.26 35.88,48.57 U$17.4 | R45.2 36.2,49.85 36.2,48.26
N$52
  Top 0.406: U$16.1 36.51,59.38 36.2,59.69 36.2,60.96 | 36.2,60.96 35.88,61.27 U$16.4 | R43.2 36.2,62.55 36.2,60.96
N$53
  Top 0.406: U$20.1 36.51,33.98 36.2,34.29 36.2,34.92 36.2,35.56 | 36.2,35.56 35.88,35.88 U$20.4 | R47.2 36.2,37.15 36.2,35.56
N$54
  Top 0.406: U$19.1 36.51,21.28 36.2,21.59 36.2,22.23 36.2,22.86 | 36.2,22.86 35.88,23.18 U$19.4 | R49.2 36.2,24.45 36.2,22.86
N$55
  Top 0.61: U$18.4 35.88,10.47 36.2,10.16 | 36.2,10.16 36.2,8.89 36.51,8.58 U$18.1 | 36.2,10.16 36.2,11.75 R51.2
P_3V3  (via drill 0.6)
  Top 0.406: v9.52,19.05 7.94,19.05 7.3,19.69 R14.2 R21.2
  Bottom 0.406: U$13.32 16.94,18.14 | 16.94,18.14 U$13.4 19.79,20.99 R17.1 | 16.94,18.14 14.11,15.31 U$13.27 10.37,19.05 v9.52,19.05 8.89,19.69 8.89,20.32 arc90 8.82,20.39 C16.2
P_D+  (via drill 0.6)
  Top 0.406: v13.44,17.67 13.44,14.18 R16.1
  Bottom 0.406: U$13.29 13.44,18.24 v13.44,17.67
P_D-  (via drill 0.6)
  Top 0.406: R15.1 16.51,16.4 v14.98,17.93
  Bottom 0.406: U$13.30 14.24,18.57 v14.98,17.93
P_RES  (via drill 0.6)
  Top 0.406: v8.89,15.88 7.62,17.15 R14.1 6.67,17.78 4.45,20.01 SRV_PROG.3
  Bottom 0.406: U$13.24 9.17,15.88 v8.89,15.88 7.62,15.88 C11.1
P_XTAL1
  Bottom 0.406: U$13.1 14.97,22.22 C14.2 14.97,25.67 13.97,26.67 Q2.2
P_XTAL2
  Bottom 0.406: Q2.1 18.05,25.67 C15.2 18.05,21.51 U$13.2
PDI_CK  (via drill 0.6)
  Top 0.406: R20.1 22.23,26.67 v18.41,30.48 | R23.1 17.15,33.66 v16.51,34.29 | U2.35 v10.8,43.18 9.59,41.98 U2.35
  Bottom 0.406: v10.8,43.18 10.8,40 v16.51,34.29 18.41,32.38 v18.41,30.48
PDI_DATA  (via drill 0.6)
  Top 0.406: R18.1 R19.1 | U2.34 8.95,43.12 v8.26,43.81 | R18.1 17.47,23.18 | v15.24,29.85 16.51,28.58 16.51,23.81 R18.1
  Bottom 0.406: v8.26,43.81 8.26,41.27 13.97,35.56 13.97,34.92 15.24,33.66 v15.24,29.85
PWM_S1  (via drill 0.6)
  Top 0.406: SV1.3 39.37,64.77 31.75,64.77 29.84,62.86 29.84,62.23 v26.03,58.42 | U2.20 22.23,53.56 v22.23,54.61
  Bottom 0.406: v22.23,54.61 v26.03,58.42
PWM_S2
  Top 0.406: SV2.3 39.37,52.07 31.11,52.07 28.58,49.53 23.85,49.53 U2.15
PWM_S3
  Top 0.406: SV3.3 39.37,39.37 27.94,39.37 26.67,40.64 26.67,46.99 25.4,48.26 23.71,48.26 U2.14
PWM_S4
  Top 0.406: U2.11 22.86,42.54 22.87,42.54 23.49,42.54 29.21,36.83 29.21,31.75 34.29,26.67 39.37,26.67 SV4.3
PWM_S5
  Top 0.406: SV5.3 39.37,13.97 32.39,13.97 29.84,16.51 29.84,26.67 27.94,28.58 27.94,36.83 23.49,41.27 22.86,41.27 22.24,41.9 U2.10
S_EN  (via drill 0.6)
  Top 0.406: 58.89,64.31 v59.06,64.14
  Top 0.813: R11.1 v59.06,23.5 v59.06,33.66 v59.06,43.81 v59.06,53.98 v59.06,64.14 59.06,66.68 56.52,69.22 53.34,69.22 52.53,70.02 Q1.3
  Bottom 0.61: U$1.4 58.14,64.14 v59.06,64.14 | U$3.4 58.14,53.98 v59.06,53.98 | U$5.4 58.14,43.81 v59.06,43.81 | U$7.4 58.14,33.66 v59.06,33.66 | U$9.4 58.14,23.5 v59.06,23.5
UART_RX  (via drill 0.6)
  Top 0.406: U2.13 22.94,46.35 v24.77,46.35 | v23.49,52.07 23.49,60.32 19.05,64.77 TP_UART.2
  Bottom 0.406: v23.49,52.07 23.49,47.62 v24.77,46.35 | 18.78,64.77 TP_UART.2 18.69,65.41 17.15,65.41 16.19,64.45 IC1.4
UART_TX  (via drill 0.6)
  Top 0.406: U2.12 23.49,45.09 v24.13,44.45 | v24.77,52.7 24.77,61.59 19.69,66.68 19.41,66.68 TP_UART.1
  Bottom 0.406: v24.77,52.7 24.77,48.89 26.03,47.62 26.03,45.72 24.77,44.45 v24.13,44.45 | IC1.1 16.83,66.36 17.15,66.68 18.69,66.68 TP_UART.1
USB_PWR_DET
  Bottom 0.406: U$13.6 20.11,19.05 21.59,19.05 22.19,19.65 R17.2
USBDM  (via drill 0.6)
  Top 0.406: R27.1 11.43,62.23 v10.16,60.96
  Bottom 0.406: IC1.9 9.98,61.14 v10.16,60.96
USBDP  (via drill 0.6)
  Top 0.406: R28.1 13.97,62.23 v15.24,60.96
  Bottom 0.406: IC1.8 15.42,61.14 v15.24,60.96
V_USB2
  Bottom 0.406: C24.1 8.94,63.82 IC1.12 11.11,63.82 11.43,64.14 11.43,69.85 12.04,70.45 U1.VBUS1
V_USB_CHG  (via drill 0.6)
  Top 0.406: R38.1 31.11,57.46 v31.11,58.42
  Top 0.813: v42.55,6.98 v42.55,8.26 v42.55,13.97 | U$24.1 43.18,25.89 v43.18,24.77 v43.18,23.5 43.18,22.86 45.08,20.96 v45.08,20.32 45.08,18.57 U$25.1 44.77,18.73 45.08,19.05
  Top 1.016: v12.06,21.59 13.97,21.59 19.05,16.51 19.05,10.79 v17.78,9.53 24.13,9.53 30.48,3.17 v41.28,3.17 | v48.89,3.17 v41.28,3.17 | v42.55,3.17 v41.28,3.17 | U$21.1 v42.86,62.86 42.86,56.2 v43.18,55.88 | U$23.1 42.86,37.46 | 42.86,37.46 42.86,30.8 | v43.18,30.48 42.86,30.8 | v43.18,50.16 42.86,50.48 U$22.1 42.86,43.49 v43.18,43.18 v43.18,44.45 | v43.18,36.2 v43.18,37.46 42.86,37.46 | 42.86,30.8 43.18,31.12 v43.18,31.75
  Bottom 0.406: v17.78,9.53 17.78,7.89 C12.1 17.78,7.25 17.78,6.98 16.54,5.75 U3.VBUS1 | U$13.31 12.35,21.59 v12.06,21.59 | v31.11,58.42 31.11,63.5 38.73,71.12 41.28,71.12 42.86,69.53 v42.86,62.86
  Bottom 0.61: U$14.4 49.17,3.17 v48.89,3.17
  Bottom 0.813: v42.55,13.97 42.55,15.24 45.08,17.78 v45.08,20.32 | v41.28,3.17 v42.55,3.17 v42.55,6.98 v42.55,8.26
  Bottom 1.016: v43.18,57.15 v43.18,55.88 v43.18,50.16 v43.18,48.89 | v43.18,43.18 v43.18,44.45 v43.18,36.2 | v43.18,31.75 v43.18,24.77 v43.18,23.5
VA_S1  (via drill 0.6)
  Top 0.406: R43.1 32.7,62.86 R44.1 32.07,62.23 31.11,62.23 30.48,61.59 30.48,60.96 26.03,56.52 v26.03,52.07 | v19.05,43.18 18.41,42.54 18.41,41.27 U2.6
  Bottom 0.406: v19.05,43.18 25.4,43.18 27.31,45.09 27.31,48.26 26.03,49.53 v26.03,52.07
VA_S2  (via drill 0.6)
  Top 0.406: R45.1 32.7,50.16 R46.1 32.07,49.53 30.48,49.53 28.58,47.62 v28.58,40.64 | U2.4 19.96,37.46 24.13,37.46 v24.77,38.1
  Bottom 0.406: v24.77,38.1 26.03,38.1 v28.58,40.64
VA_S3  (via drill 0.6)
  Top 0.406: R47.1 32.7,37.46 R48.1 30.8,37.14 v30.48,37.46 | U2.2 18.97,36.2 25.4,36.2 26.03,35.56 v26.67,35.56
  Bottom 0.406: v26.67,35.56 28.58,35.56 v30.48,37.46
VA_S4  (via drill 0.6)  (1 unrouted)
  Top 0.406: R49.1 32.39,24.77 | 32.39,24.77 R50.1 | 14.04,37.53 17.15,40.64 17.15,43.18 v16.51,43.81 | 32.39,24.77 31.11,26.04 31.11,27.94 v29.21,29.85
  Bottom 0.406: v16.51,43.81 25.4,34.92 25.4,33.66 v29.21,29.85
VA_S5  (via drill 0.6)
  Top 0.406: R51.1 32.7,12.06 R52.1 32.39,12.06 28.58,15.88 v28.58,26.04 | U2.40 13.34,40.14 v13.34,41.27
  Top 0.61: 34.29,12.06 R51.1
  Bottom 0.406: v13.34,41.27 v28.58,26.04
VB  (via drill 0.6)
  Top 0.406: R37.1 25.4,29.21 27.31,27.31 27.31,15.24 v30.48,12.06 | 58.42,14.61 59.06,15.56
  Top 0.61: L1.P$2 57.78,61.55 | C21.1 44.72,12.33 v45.72,13.33 46.99,14.61 58.42,14.61 | 57.5,47.91 v57.78,47.62
  Top 0.813: C1.1 v57.78,57.78 | C7.1 56.28,37.5 57.75,37.5 v57.78,37.46 57.5,37.75 | 57.75,27.31 C5.1 v57.78,27.31 57.5,27.6 | L1.P$2 57.5,58.07 v57.78,57.78 | v57.78,57.78 57.5,57.49 L2.P$2 57.5,47.91 | C3.1 v57.78,47.62 57.5,47.34 L3.P$2 57.5,37.75 | 57.5,37.75 L4.P$2 57.5,27.6 | 57.5,27.6 L5.P$2 57.5,18.12 v56.52,17.15 | v56.52,17.15 C9.1 | S1.1 59.06,15.56 R11.2 56.83,16.83 v56.52,17.15
  Bottom 0.406: v30.48,12.06 41.91,12.06 43.18,10.79 C21.1 U$15.1 44.77,11.12
  Bottom 0.61: U$15.3 46.67,12.38 v45.72,13.33 44.77,12.38 44.77,11.12 U$15.1
  Bottom 0.813: U$5.5 56.55,38.7 v57.78,37.46 | v57.78,57.78 56.55,59.02 U$1.5 | U$7.5 56.55,28.54 v57.78,27.31 | U$9.5 56.55,18.38 v56.52,17.15 | U$3.5 56.55,48.86 v57.78,47.62
  pour Top (no thermals): 59.06,13.33 59.06,17.15 55.88,17.15 55.25,16.51 55.25,14.61 57.78,14.61
VC_S1  (via drill 0.6)
  Top 0.406: SV1.1 38.73,69.22 35.56,66.04 31.75,66.04 v26.03,60.32 | U2.5 17.78,40.78 v17.78,44.45
  Top 1.27: SV1.1 R31.2
  Bottom 0.406: v26.03,60.32 20.95,55.24 20.95,47.62 v17.78,44.45
VC_S2  (via drill 0.6)
  Top 0.406: R32.2 36.51,56.52 34.92,56.52 31.75,53.34 30.48,53.34 v29.84,52.7 | v29.84,41.91 v29.84,46.99 | U2.7 21.45,39.37 v23.49,39.37
  Top 0.813: SV2.1 37.15,56.52 R32.2
  Bottom 0.406: v23.49,39.37 25.4,39.37 27.94,41.91 v29.84,41.91 | v29.84,46.99 v29.84,52.7
VC_S3  (via drill 0.6)
  Top 0.406: v31.11,40.64 33.66,43.18 36.83,43.18 37.47,43.81 | U2.3 19.47,36.83 v26.03,36.83
  Top 0.813: R33.2 37.15,43.81 37.47,43.81 SV3.1
  Bottom 0.406: v31.11,40.64 27.31,36.83 v26.03,36.83
VC_S4  (via drill 0.6)
  Top 0.406: v30.48,33.02 32.7,30.8 R34.2 | U2.1 18.47,35.56 24.77,35.56 26.03,34.29 v26.67,34.29
  Top 0.813: SV4.1 37.15,31.12 R34.2
  Bottom 0.406: v26.67,34.29 29.21,34.29 v30.48,33.02
VC_S5  (via drill 0.6)
  Top 0.406: U2.41 15.24,40.92 v15.24,41.27 | 37.15,18.42 36.52,17.78 32.39,17.78 31.11,19.05 v31.11,20.96
  Top 0.813: R35.2 37.15,18.42 SV5.1
  Bottom 0.406: v15.24,41.27 31.11,25.4 v31.11,20.96
VFB1  (via drill 0.6)
  Top 0.61: R1.1 49.53,65.41
  Top 0.813: R2.2 v52.07,65.41 R1.1
  Bottom 0.61: U$1.3 53.94,63.54 v52.07,65.41
VFB2  (via drill 0.6)
  Top 0.813: R4.2 v50.8,55.24 R3.1
  Bottom 0.61: U$3.3 52.39,52.38 50.8,53.98 v50.8,55.24
VFB3  (via drill 0.6)
  Top 0.813: R6.2 v50.8,45.09 R5.1
  Bottom 0.61: U$5.3 52.39,42.23 50.8,43.81 v50.8,45.09
VFB4  (via drill 0.6)
  Top 0.813: R8.2 v50.8,34.92 R7.1
  Bottom 0.61: U$7.3 52.39,32.06 50.8,33.66 v50.8,34.92
VFB5  (via drill 0.6)
  Top 0.813: R10.2 v50.8,24.77 R9.1
  Bottom 0.61: U$9.3 53.03,21.91 50.8,23.5 v50.8,24.77
XTAL1
  Top 0.406: U2.36 8.86,40.19 Q3.2
  Bottom 0.406: Q3.2 3.89,39.19 C22.2
XTAL2
  Top 0.406: Q3.1 10.63,40.84 U2.37
  Bottom 0.406: Q3.1 3.89,36.11 C23.2

### Text on the board
tPlace: ESP8266 | SRV
tNames: CTR | TP0
bNames: <Vee | <Vcc | <V_PWM | <VA | <Vee | <Vcc | <V_PWM | <VA | <Vee | <Vcc | <V_PWM | <VA | <Vee | <Vcc | <V_PWM | <VA | <Vee | <Vcc | <V_PWM | <VA